# Altium project LOGTURTLE_APR_25_TX.PrjPcb (part 1 of 2)
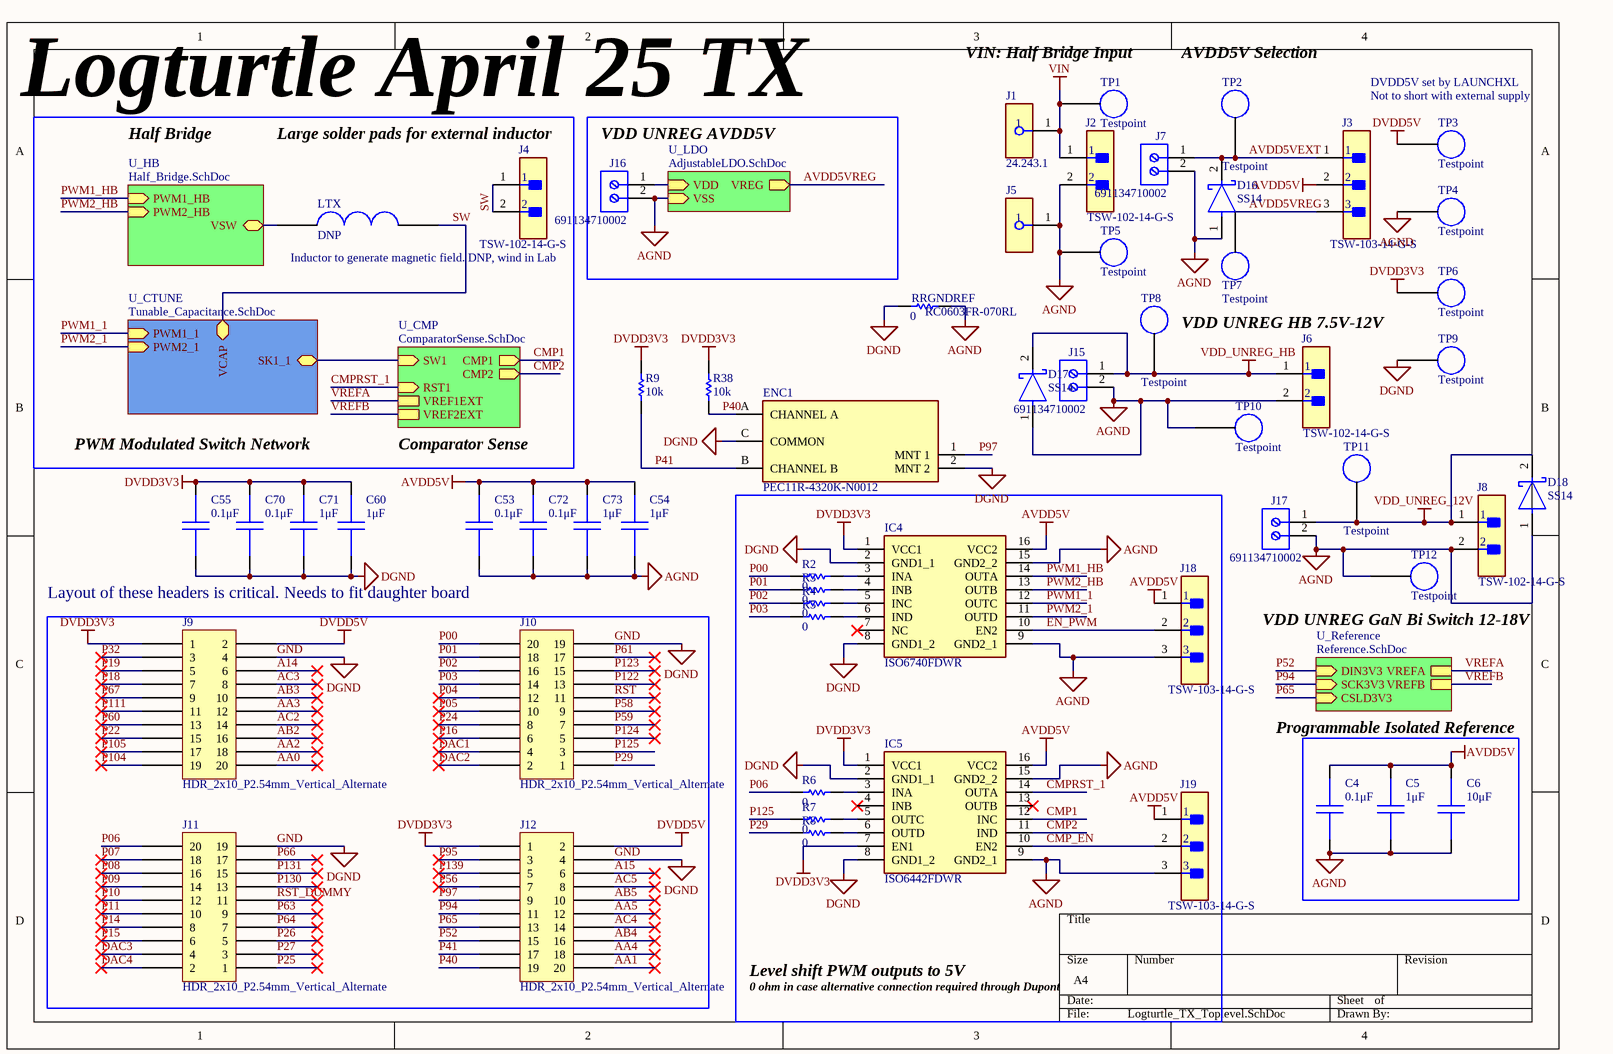
[diagram p0: Logturtle_TX_Toplevel.SchDoc]
7 sheets, 253 parts. Net scope: hierarchical (ports join the sheet entries above them; power ports are global).
Board file: LOGTURTLE_APR_25_TX.PcbDoc
Sheets:
  Logturtle_TX_Toplevel.SchDoc
    U_HB = Half_Bridge.SchDoc
    U_CTUNE = Tunable_Capacitance.SchDoc
      BiG1 = BiGaN.SchDoc
    U_CMP = ComparatorSense.SchDoc
    U_LDO = AdjustableLDO.SchDoc
    U_Reference = Reference.SchDoc

## Sheet Logturtle_TX_Toplevel.SchDoc
size A4; SheetNumber: 1; SheetTotal: 7

### Parts
C4  0.1μF  [CAPC1608X90N]
C5  1μF  [CAPC1608X09N]
C6  10μF  [CAPC2012X14N]
C53  0.1μF  [CAPC1608X90N]
C54  1μF  [CAPC1608X09N]
C55  0.1μF  [CAPC1608X90N]
C60  1μF  [CAPC1608X09N]
C70  0.1μF  [CAPC1608X90N]
C71  1μF  [CAPC1608X09N]
C72  0.1μF  [CAPC1608X90N]
C73  1μF  [CAPC1608X09N]
D16  SS14  [FP-403AE-MFG]
D17  SS14  [FP-403AE-MFG]
D18  SS14  [FP-403AE-MFG]
ENC1  PEC11R-4320K-N0012  [FP-PEC11R-4320K-N0012-MFG]
IC4  ISO6740FDWR  [SOIC127P1030X255-16N]
IC5  ISO6442FDWR  [SOIC127P1030X255-16N]
J1  24.243.1  [FP-24_243_1-MFG]
J2  TSW-102-14-G-S  [FP-TSW-102-14-G-S-MFG]
J3  TSW-103-14-G-S  [FP-TSW-103-14-G-S-MFG]
J4  TSW-102-14-G-S  [FP-TSW-102-14-G-S-MFG]
J5  (no value)  [FP-24_243_2-MFG]
J6  TSW-102-14-G-S  [FP-TSW-102-14-G-S-MFG]
J7  691134710002  [691134710002]
J8  TSW-102-14-G-S  [FP-TSW-102-14-G-S-MFG]
J9  HDR_2x10_P2.54mm_Vertical_Alternate  [HDR_2x10_P2.54mm_Vertical - Alternate]
J10  HDR_2x10_P2.54mm_Vertical_Alternate  [HDR_2x10_P2.54mm_Vertical - Alternate]
J11  HDR_2x10_P2.54mm_Vertical_Alternate  [HDR_2x10_P2.54mm_Vertical - Alternate]
J12  HDR_2x10_P2.54mm_Vertical_Alternate  [HDR_2x10_P2.54mm_Vertical - Alternate]
J15  691134710002  [691134710002]
J16  691134710002  [691134710002]
J17  691134710002  [691134710002]
J18  TSW-103-14-G-S  [FP-TSW-103-14-G-S-MFG]
J19  TSW-103-14-G-S  [FP-TSW-103-14-G-S-MFG]
LTX  DNP  [InductorTerminals]
R2  value 0  [RESC1608X55N]  (hidden comment: RC0603FR-070RL)
R3  value 0  [RESC1608X55N]  (hidden comment: RC0603FR-070RL)
R4  value 0  [RESC1608X55N]  (hidden comment: RC0603FR-070RL)
R5  value 0  [RESC1608X55N]  (hidden comment: RC0603FR-070RL)
R6  value 0  [RESC1608X55N]  (hidden comment: RC0603FR-070RL)
R7  value 0  [RESC1608X55N]  (hidden comment: RC0603FR-070RL)
R8  value 0  [RESC1608X55N]  (hidden comment: RC0603FR-070RL)
R9  value 10k  [RESC1608X55N]  (hidden comment: RC0603FR0710KL)
R38  value 10k  [RESC1608X55N]  (hidden comment: RC0603FR0710KL)
RRGNDREF  RC0603FR-070RL  value 0  [RESC1608X55N]
TP1  Testpoint  [TP_5006]
TP2  Testpoint  [TP_5006]
TP3  Testpoint  [TP_5006]
TP4  Testpoint  [TP_5006]
TP5  Testpoint  [TP_5006]
TP6  Testpoint  [TP_5006]
TP7  Testpoint  [TP_5006]
TP8  Testpoint  [TP_5006]
TP9  Testpoint  [TP_5006]
TP10  Testpoint  [TP_5006]
TP11  Testpoint  [TP_5006]
TP12  Testpoint  [TP_5006]

### Blocks framed on the sheet
VDD UNREG AVDD5V: J16
Level shift PWM outputs to 5V: IC4 IC5 J18 J19 R2-R8

### Sub-sheets
U_CMP = ComparatorSense.SchDoc: SW1 (in), CMP1 (out), CMP2 (out), RST1 (in), VREF1EXT, VREF2EXT
U_CTUNE = Tunable_Capacitance.SchDoc: PWM1_1 (in), PWM2_1 (in), VCAP (bidir), SK1_1 (bidir)
U_HB = Half_Bridge.SchDoc: VSW (bidir), PWM1_HB (in), PWM2_HB (in)
U_LDO = AdjustableLDO.SchDoc: VDD (in), VREG (out), VSS (in)
U_Reference = Reference.SchDoc: VREFA, VREFB, DIN3V3 (in), SCK3V3 (in), CSLD3V3 (in)

### Nets
AGND: C4.1 C5.1 C6.1 C53.1 C54.1 C72.1 C73.1 D16.1(A) D17.1(A) D18.1(A) IC4.9(GND2_1) IC4.15(GND2_2) IC5.9(GND2_1) IC5.15(GND2_2) J2.2 J5.1 J6.2 J7.2 J8.2 J15.2 J16.2 J17.2 J18.3 J19.3 RRGNDREF.1 TP4.1 TP5.1 TP10.1 TP12.1 ; sheet U_LDO/VSS  [project net S2]
AVDD5V: C4.2 C5.2 C6.2 C53.2 C54.2 C72.2 C73.2 IC4.16(VCC2) IC5.16(VCC2) J3.2 J18.1 J19.1
DVDD3V3: C55.2 C60.2 C70.2 C71.2 IC4.1(VCC1) IC5.1(VCC1) IC5.7(EN1) J9.1 J12.1 R9.2 R38.2 TP6.1
DVDD5V: J9.2 J12.2 TP3.1
GND: C55.1 C60.1 C70.1 C71.1 ENC1.2(MNT_2) ENC1.C(COMMON) IC4.2(GND1_1) IC4.8(GND1_2) IC5.2(GND1_1) IC5.8(GND1_2) J9.4 J10.19 J11.19 J12.4 RRGNDREF.2 TP9.1  [also labelled DGND]
VDD_UNREG_12V: D18.2(C) J8.1 J17.1 TP11.1
VDD_UNREG_HB: D17.2(C) J6.1 J15.1 TP8.1
VIN: J1.1 J2.1 TP1.1
A14: J9.6
A15: J12.6
AA0: J9.20
AA1: J12.20
AA2: J9.18
AA3: J9.12
AA4: J12.18
AA5: J12.12
AB2: J9.16
AB3: J9.10
AB4: J12.16
AB5: J12.10
AC2: J9.14
AC3: J9.8
AC4: J12.14
AC5: J12.8
AVDD5VEXT: D16.2(C) J3.1 J7.1 TP2.1
AVDD5VREG: J3.3 TP7.1 ; sheet U_LDO/VREG
CMP1: IC5.12(INC) ; sheet U_CMP/CMP1
CMP2: IC5.11(IND) ; sheet U_CMP/CMP2
CMP_EN: IC5.10(EN2) J19.2
CMPRST_1: IC5.14(OUTA) ; sheet U_CMP/RST1
DAC1: J10.4
DAC2: J10.2
DAC3: J11.4
DAC4: J11.2
EN_PWM: IC4.10(EN2) J18.2
P00: J10.20 R2.1
P01: J10.18 R3.1
P02: J10.16 R4.1
P03: J10.14 R5.1
P04: J10.12
P05: J10.10
P06: J11.20 R6.1
P07: J11.18
P08: J11.16
P09: J11.14
P10: J11.12
P11: J11.10
P14: J11.8
P15: J11.6
P16: J10.6
P18: J9.7
P19: J9.5
P22: J9.15
P24: J10.8
P25: J11.1
P26: J11.5
P27: J11.3
P29: J10.1 R8.1
P32: J9.3
P40: ENC1.A(CHANNEL_A) J12.19 R38.1
P41: ENC1.B(CHANNEL_B) J12.17 R9.1
P52: J12.15 ; sheet U_Reference/DIN3V3  [project net DIN3V3]
P56: J12.7
P58: J10.9
P59: J10.7
P60: J9.13
P61: J10.17
P63: J11.9
P64: J11.7
P65: J12.13 ; sheet U_Reference/CSLD3V3  [project net CSLD3V3]
P66: J11.17
P67: J9.9
P94: J12.11 ; sheet U_Reference/SCK3V3
P95: J12.3
P97: ENC1.1(MNT_1) J12.9
P104: J9.19
P105: J9.17
P111: J9.11
P122: J10.13
P123: J10.15
P124: J10.5
P125: J10.3 R7.1
P130: J11.13
P131: J11.15
P139: J12.5
PWM1_1: IC4.12(OUTC) ; sheet U_CTUNE/PWM1_1
PWM1_HB: IC4.14(OUTA) ; sheet U_HB/PWM1_HB
PWM2_1: IC4.11(OUTD) ; sheet U_CTUNE/PWM2_1
PWM2_HB: IC4.13(OUTB) ; sheet U_HB/PWM2_HB
RST: J10.11
RST_DUMMY: J11.11
S1: sheet U_CTUNE/SK1_1, sheet U_CMP/SW1
SW: J4.1 J4.2 LTX.2 ; sheet U_CTUNE/VCAP
VREFA: sheet U_CMP/VREF1EXT, sheet U_Reference/VREFA  [project net VREF1EXT]
VREFB: sheet U_CMP/VREF2EXT, sheet U_Reference/VREFB  [project net VREF2EXT]
VSW: LTX.1 ; sheet U_HB/VSW
NetC1_2: J16.1 ; sheet U_LDO/VDD
NetIC4_3: IC4.3(INA) R2.2
NetIC4_4: IC4.4(INB) R3.2
NetIC4_5: IC4.5(INC) R4.2
NetIC4_6: IC4.6(IND) R5.2
NetIC5_3: IC5.3(INA) R6.2
NetIC5_5: IC5.5(OUTC) R7.2
NetIC5_6: IC5.6(OUTD) R8.2

Not connected (* = marked no-connect by the designer): IC4 7(NC)*; IC5 4(INB)* 13(OUTB)*

### Notes on the sheet
- (near TP1) VIN: Half Bridge Input
- AVDD5V Selection
- Logturtle April 25 TX
- DVDD5V set by LAUNCHXL
- Not to short with external supply
- Half Bridge
- Large solder pads for external inductor
- Inductor to generate magnetic field. DNP, wind in Lab
- VDD UNREG HB 7.5V-12V
- PWM Modulated Switch Network
- Comparator Sense
- Layout of these headers is critical. Needs to fit daughter board
- (near TP12) VDD UNREG GaN Bi Switch 12-18V
- Programmable Isolated Reference
- 0 ohm in case alternative connection required through Dupont

### Library data of the parts
C4 C53 C55 C70 C72 = CC0603KRX7R7BB104: Ceramic Capacitor, Multilayer, Ceramic, 16V, 10% +Tol, 10% -Tol, X7R, 15% TC, 0.1uF, Surface Mount, 0603 https://www.digikey.ie/en/products/detail/yageo/CC0603KRX7R7BB104/302822; Manufacturer: Yageo; Value: 100nF; Multilayer: Yes; Supplier: Digikey; Supplier Part Number: 311-1088-1-ND; Manufacturer Part Number: CC0603KRX7R7BB104; RoHS: Yes; Category: Ceramic Capacitors; Stock: 8597331; Mounting Technology: Surface Mount; Pins: 2; Dielectric Material: Ceramic; Package Shape: Rectangular; Case/Package: 0603; Terminal Finish: Nickel; Min Operating Temperature: -55°C; Max Operating Temperature: 125°C; JESD-609 Code: e3; Capacitor Type: Ceramic; Tolerance  (fill in as +-): 10%; Package Style: SMTMeter; Packaging: Tape and Reel; Tolerance (fill in as +-): 10%; Rated DC Voltage (URdc): 16V; Temperature Characteristics Code: X7R; Termination: Wraparound; Length: 1.6mm; Width: 0.8mm; Height: 0.8mm; Reach SVHC Compliant: Yes; RoHS Compliant: Yes; ComponentLink1URL: https://datasheet.ciiva.com:443/pdfs/VipMasterIC/IC/YAGO/YAGO-S-A0003557223/YAGO-S-A0003557223-1.pdf?src-supplier=IHS+Markit; ComponentLink1Description: https://datasheet.ciiva.com:443/pdfs/VipMasterIC/IC/YAGO/YAGO-S-A0003557223/YAGO-S-A0003557223-1.pdf?src-supplier=IHS+Markit; ComponentLink2URL: https://datasheet.ciiva.com/11786/0900766b80d84f1d-11786077.pdf?src-supplier=Rs; ComponentLink2Description: https://datasheet.ciiva.com/11786/0900766b80d84f1d-11786077.pdf?src-supplier=Rs; ComponentLink3URL: https://datasheet.ciiva.com/8033/70765-8033799.pdf?src-supplier=Element14; ComponentLink3Description: https://datasheet.ciiva.com/8033/70765-8033799.pdf?src-supplier=Element14; ComponentLink4URL: https://datasheet.ciiva.com/7978/1489800-7978141.pdf?src-supplier=Element14; ComponentLink4Description: https://datasheet.ciiva.com/7978/1489800-7978141.pdf?src-supplier=Element14; ComponentLink5URL: https://datasheet.ciiva.com/28450/1489800-28450552.pdf?src-supplier=Element14; ComponentLink5Description: https://datasheet.ciiva.com/28450/1489800-28450552.pdf?src-supplier=Element14; ComponentLink6URL: https://datasheet.ciiva.com/46430/1734573-46430156.pdf?src-supplier=Element14; ComponentLink6Description: https://datasheet.ciiva.com/46430/1734573-46430156.pdf?src-supplier=Element14; ComponentLink7URL: https://datasheet.ciiva.com/144/mlccorderingcode-144183.pdf?src-supplier=Digikey; ComponentLink7Description: https://datasheet.ciiva.com/144/mlccorderingcode-144183.pdf?src-supplier=Digikey; ComponentLink8URL: https://datasheet.ciiva.com/144/mlccorderingcode-144182.pdf?src-supplier=Digikey; ComponentLink8Description: https://datasheet.ciiva.com/144/mlccorderingcode-144182.pdf?src-supplier=Digikey; ComponentLink9URL: https://datasheet.ciiva.com/144/mlccorderingcode-144184.pdf?src-supplier=Digikey; ComponentLink9Description: https://datasheet.ciiva.com/144/mlccorderingcode-144184.pdf?src-supplier=Digikey; ComponentLink10URL: https://datasheet.ciiva.com/8033/1734573-8033797.pdf?src-supplier=Element14; ComponentLink10Description: https://datasheet.ciiva.com/8033/1734573-8033797.pdf?src-supplier=Element14; ComponentLink11URL: https://datasheet.ciiva.com/13395/upy-gphc-x7r-6-3v-to-50v-8-13395674.pdf?src-supplier=Mouser; ComponentLink11Description: https://datasheet.ciiva.com/13395/upy-gphc-x7r-6-3v-to-50v-8-13395674.pdf?src-supplier=Mouser
C5 C54 C60 C71 C73 = CC0603KRX7R7BB105: Ceramic Capacitor, Multilayer, Ceramic, 16V, 10% +Tol, 10% -Tol, X7R, 15% TC, 1uF, Surface Mount, 0603 https://www.digikey.ie/en/products/detail/yageo/CC0603KRX7R7BB105/2833611; Manufacturer: Yageo; Multilayer: Yes; Supplier: Digikey; Supplier Part Number: 311-1446-6-ND; Manufacturer Part Number: CC0603KRX7R7BB105; RoHS: Yes; Category: Ceramic Capacitors; Stock: 9128438; Mounting Technology: Surface Mount; Pins: 2; Dielectric Material: Ceramic; Package Shape: Rectangular; Case/Package: 0603; Terminal Finish: Nickel; Min Operating Temperature: -55°C; Max Operating Temperature: 125°C; JESD-609 Code: e3; Value: 1uF; Capacitor Type: Ceramic; Tolerance  (fill in as +-): 10%; Package Style: SMTMeter; Packaging: Tape and Reel; Tolerance (fill in as +-): 10%; Rated DC Voltage (URdc): 16V; Temperature Characteristics Code: X7R; Termination: Wraparound; Length: 1.6mm; Width: 0.8mm; Height: 0.8mm; Reach SVHC Compliant: Yes; RoHS Compliant: Yes; ComponentLink1URL: https://datasheet.ciiva.com:443/pdfs/VipMasterIC/IC/YAGO/YAGO-S-A0003557223/YAGO-S-A0003557223-1.pdf?src-supplier=IHS+Markit; ComponentLink1Description: https://datasheet.ciiva.com:443/pdfs/VipMasterIC/IC/YAGO/YAGO-S-A0003557223/YAGO-S-A0003557223-1.pdf?src-supplier=IHS+Markit; ComponentLink2URL: https://datasheet.ciiva.com/8033/1734573-8033801.pdf?src-supplier=Element14; ComponentLink2Description: https://datasheet.ciiva.com/8033/1734573-8033801.pdf?src-supplier=Element14; ComponentLink3URL: https://datasheet.ciiva.com/8033/1734573-8033800.pdf?src-supplier=Element14; ComponentLink3Description: https://datasheet.ciiva.com/8033/1734573-8033800.pdf?src-supplier=Element14; ComponentLink4URL: https://datasheet.ciiva.com/7978/1489800-7978143.pdf?src-supplier=Element14; ComponentLink4Description: https://datasheet.ciiva.com/7978/1489800-7978143.pdf?src-supplier=Element14; ComponentLink5URL: https://datasheet.ciiva.com/28450/1489800-28450557.pdf?src-supplier=Element14; ComponentLink5Description: https://datasheet.ciiva.com/28450/1489800-28450557.pdf?src-supplier=Element14; ComponentLink6URL: https://datasheet.ciiva.com/176/mlccorderingcode-176789.pdf?src-supplier=Digikey; ComponentLink6Description: https://datasheet.ciiva.com/176/mlccorderingcode-176789.pdf?src-supplier=Digikey; ComponentLink7URL: https://datasheet.ciiva.com/176/mlccorderingcode-176788.pdf?src-supplier=Digikey; ComponentLink7Description: https://datasheet.ciiva.com/176/mlccorderingcode-176788.pdf?src-supplier=Digikey; ComponentLink8URL: https://datasheet.ciiva.com/176/mlccorderingcode-176790.pdf?src-supplier=Digikey; ComponentLink8Description: https://datasheet.ciiva.com/176/mlccorderingcode-176790.pdf?src-supplier=Digikey; ComponentLink9URL: https://datasheet.ciiva.com/5425/upy-gphc-x7r-6-3v-to-50v-8-12304-5425495.pdf?src-supplier=Mouser; ComponentLink9Description: https://datasheet.ciiva.com/5425/upy-gphc-x7r-6-3v-to-50v-8-12304-5425495.pdf?src-supplier=Mouser
C6 = GRM21BZ71E106KE15L: Multilayer Ceramic Capacitor, 10 uF, 25 V, ï¿½ 10%, X7R, 0805 [2012 Metric] https://www.digikey.ie/en/products/detail/murata-electronics/GRM21BZ71E106KE15L/13904911; Manufacturer: Murata; Material: 4241ConductorMaterial; Value: 10uF; Voltage Rating: 25V; Supplier: Future Electronics; Supplier Part Number: 6134628; Manufacturer Part Number: GRM21BZ71E106KE15L; Category: Ceramic Capacitors; Stock: 81000; Case/Package: 339Case; Min Operating Temperature: -55°C; Max Operating Temperature: 125°C; Tolerance: 10%; Length: 2mm; Width: 1.25mm; Height: 1.45mm; Thickness: 1.25mm; RoHS Compliant: Yes; ComponentLink1URL: https://datasheet.octopart.com/GRM21BZ71E106KE15L-Murata-datasheet-141278873.pdf?src-supplier=Geoflip; ComponentLink1Description: https://datasheet.octopart.com/GRM21BZ71E106KE15L-Murata-datasheet-141278873.pdf?src-supplier=Geoflip; ComponentLink2URL: https://datasheet.octopart.com/GRM21BZ71E106KE15L-Murata-datasheet-165579666.pdf?src-supplier=TME; ComponentLink2Description: https://datasheet.octopart.com/GRM21BZ71E106KE15L-Murata-datasheet-165579666.pdf?src-supplier=TME; ComponentLink3URL: https://datasheet.octopart.com/GRM21BZ71E106KE15L-Murata-datasheet-140707837.pdf?src-supplier=Ciiva+Crawler; ComponentLink3Description: https://datasheet.octopart.com/GRM21BZ71E106KE15L-Murata-datasheet-140707837.pdf?src-supplier=Ciiva+Crawler; ComponentLink4URL: https://datasheet.octopart.com/GRM21BZ71E106KE15L-Murata-datasheet-138745134.pdf?src-supplier=Ciiva+Crawler; ComponentLink4Description: https://datasheet.octopart.com/GRM21BZ71E106KE15L-Murata-datasheet-138745134.pdf?src-supplier=Ciiva+Crawler
D16-D18 = CMP-2000-04943-2: DIODE SCHOTTKY 40V 1A SMA; Manufacturer: ON Semiconductor; Peak Reverse Current: 0.2mA; Max Junction Temp: +125°C; Standoff Height: 0.05mm; Max Surge Forward Current: 40A; Mouser Description: Schottky Diodes & Rectifiers SMA 40V 1.0A; RoHS: TRUE; Lead Free: Yes; Manufacturer Part Number: SS14; Device Class L3: Schottky Diodes; Category: Diode; Automotive: No; Digikey Description: DIODE SCHOTTKY 40V 1A SMA; ComponentLink2Description: Datasheet; Device Class L2: Diodes; Height: 2.5mm; Temperature Range High: +125°C; ComponentLink2URL: https://www.onsemi.com/pub/Collateral/SS19-D.PDF; Device Class L1: Discrete Semiconductors; Package: 403AE; Octopart: https://octopart.com/ss14-on+semiconductor-29205033; Max Repetitive Reverse Voltage: 40V; Temperature Range Low: -65°C; Forward Current: 1A; Temperature: -65°C to +125°C
ENC1 = CMP-07421-000024-1: ROTARY ENCODER MECHANICAL 12PPR; Detent: Yes; Built in Switch: No; Number of Channels: 2; Pulses per Revolution: 12; Output Type: Quadrature; Width: 12.5mm; Packaging: Bulk; Mount: Through Hole; Min Operating Temperature: -30°C; Termination: PC Pin; Package Quantity: 75; Orientation: Vertical; Encoder Type: Mechanical; RoHS Compliant: Yes; Height: 13.4mm; Length: 26.5mm; Max Operating Temperature: 70°C
IC4 = ISO6440FDWR: Texas Instruments ISO6740FDWR; Manufacturer_Part_Number: ISO6441FDWR; Datasheet Link: https://www.ti.com/lit/ds/symlink/iso6441.pdf?ts=1759392249492&ref_url=https%253A%252F%252Fwww.ti.com%252Fproduct%252FISO6441; Height: 2.55mm; Manufacturer_Name: Texas Instruments
IC5 = ISO6442FDWR: Texas Instruments ISO6742FDWR; Manufacturer_Part_Number: ISO6441FDWR; Datasheet Link: https://www.ti.com/lit/ds/symlink/iso6441.pdf?ts=1759392249492&ref_url=https%253A%252F%252Fwww.ti.com%252Fproduct%252FISO6441; Height: 2.55mm; Manufacturer_Name: Texas Instruments
J1 = CMP-12400-000001-2: Banana Test Connector, 4mm, Socket, PCB Mount, 24 A, 60 VDC, Silver Plated Contacts, Green; Gender: Male; Voltage Rating: 30V; Current Rating: 20A; REACH SVHC: No SVHC; Contact Material: Brass; RoHS Compliant: Yes; Contact Plating: Silver; Voltage Rating (DC): 30V; Length: 24mm; Termination: Solder
J2 J4 J6 J8 = CMP-02766-001740-1: CONN HEADER VERT 2POS 2.54MM; Number of Positions: 2; Max Current Rating: 7.6A; Gender: Male; Max Voltage Rating (AC): 550V; Contact Mating Length: 0.32inch; REACH SVHC: No SVHC; Width: 2.54mm; Insulation Material: PBT; Contact Shape: Square; Contact Plating: Gold; Min Operating Temperature: -55°C; Contact Material: Bronze; Color: Black; Number of Contacts: 2; Housing Material: Polyester; Orientation: Straight; Flammability Rating: UL94 V-0; Max Operating Temperature: 125°C; Contact Type: Male Pin; Radiation Hardening: No; Termination: Solder; RoHS Compliant: Yes; Lead Free: Lead Free; Fastening Type: Pull; Pitch: 2.54mm; Number of Rows: 1; Series: TSW; Insulation Color: Black; Package Quantity: 1; Connector Type: Header; Length: 5.08mm; Contact Finish - Mating: GOLD; Mount: Through Hole; Housing Color: Black; Depth: 2.54mm; Packaging: Bulk
J3 J18 J19 = CMP-02766-001743-1: CONN HEADER VERT 3POS 2.54MM; Max Voltage Rating (AC): 550V; Number of Positions: 3; Max Current Rating: 7.6A; Gender: Male; Termination: Solder; RoHS Compliant: Yes; Mount: Through Hole; Lead Free: Lead Free; Connector Type: Header; REACH SVHC: No SVHC; Insulation Color: Black; Width: 2.54mm; Length: 7.62mm; Flammability Rating: UL94 V-0; Housing Material: Polyester; Contact Material: Bronze; Max Operating Temperature: 125°C; Fastening Type: Pull; Series: TSW; Number of Contacts: 3; Packaging: Bulk; Min Operating Temperature: -55°C; Package Quantity: 1; Height: 10.67mm; Pitch: 2.54mm; Contact Finish - Mating: GOLD; Contact Type: Male Pin; Radiation Hardening: No; Color: Black; Housing Color: Black; Contact Plating: Gold; Orientation: Straight; Number of Rows: 1; Depth: 2.54mm; Insulation Material: PBT; Contact Mating Length: 0.32inch; Contact Shape: Square
J5 = CMP-12400-000002-2: RECEPTACLE, 20A, 4MM, PCB, SOLDER, BLACK; Gender: Male; Current Rating: 20A; Contact Plating: Silver; Termination: Solder; Length: 24mm; REACH SVHC: No SVHC; Contact Material: Brass
J7 J15-J17 = CMP-1502-03295-3: Wire-To-Board Terminal Block, 5mm Pitch, Horizontal, Screw, 2 Poles
LTX = InductorTX
R2-R8 RRGNDREF = RC0603FR-070RL: Resistor, 0 Ohms Jumper 0.1W, 1/10W Chip Resistor 0603 (1608 Metric) Moisture Resistant Thick Film; Manufacturer_Name: YAGEO; Datasheet Link: http://www.yageo.com/documents/recent/PYu-RC0603_51_RoHS_L_v5.pdf; Height: 0.55mm; Manufacturer_Part_Number: RC0603FR-070RL; Mouser Part Number: 603-RC0603FR-070RL; Mouser Price/Stock: https://www.mouser.co.uk/ProductDetail/YAGEO/RC0603FR-070RL?qs=0yPvnVz5%2FmpDQv43TwvCfw%3D%3D; Arrow Part Number: RC0603FR-070RL; Arrow Price/Stock: https://www.arrow.com/en/products/rc0603fr-070rl/yageo?region=nac
R9 R38 = RC0603FR0710KL: Resistor, 10 kOhms ±1% 0.1W, 1/10W Chip Resistor 0603 (1608 Metric) Moisture Resistant Thick Film; Manufacturer_Name: YAGEO; Datasheet Link: http://www.yageo.com/documents/recent/PYu-RC0603_51_RoHS_L_v5.pdf; Height: 0.55mm; Manufacturer_Part_Number: RC0603FR0710KL; Arrow Part Number: RC0603FR0710KL; Arrow Price/Stock: https://www.arrow.com/en/products/rc0603fr-0710kl/yageo

## Sheet Half_Bridge.SchDoc
size A2; SheetNumber: 5; SheetTotal: 8
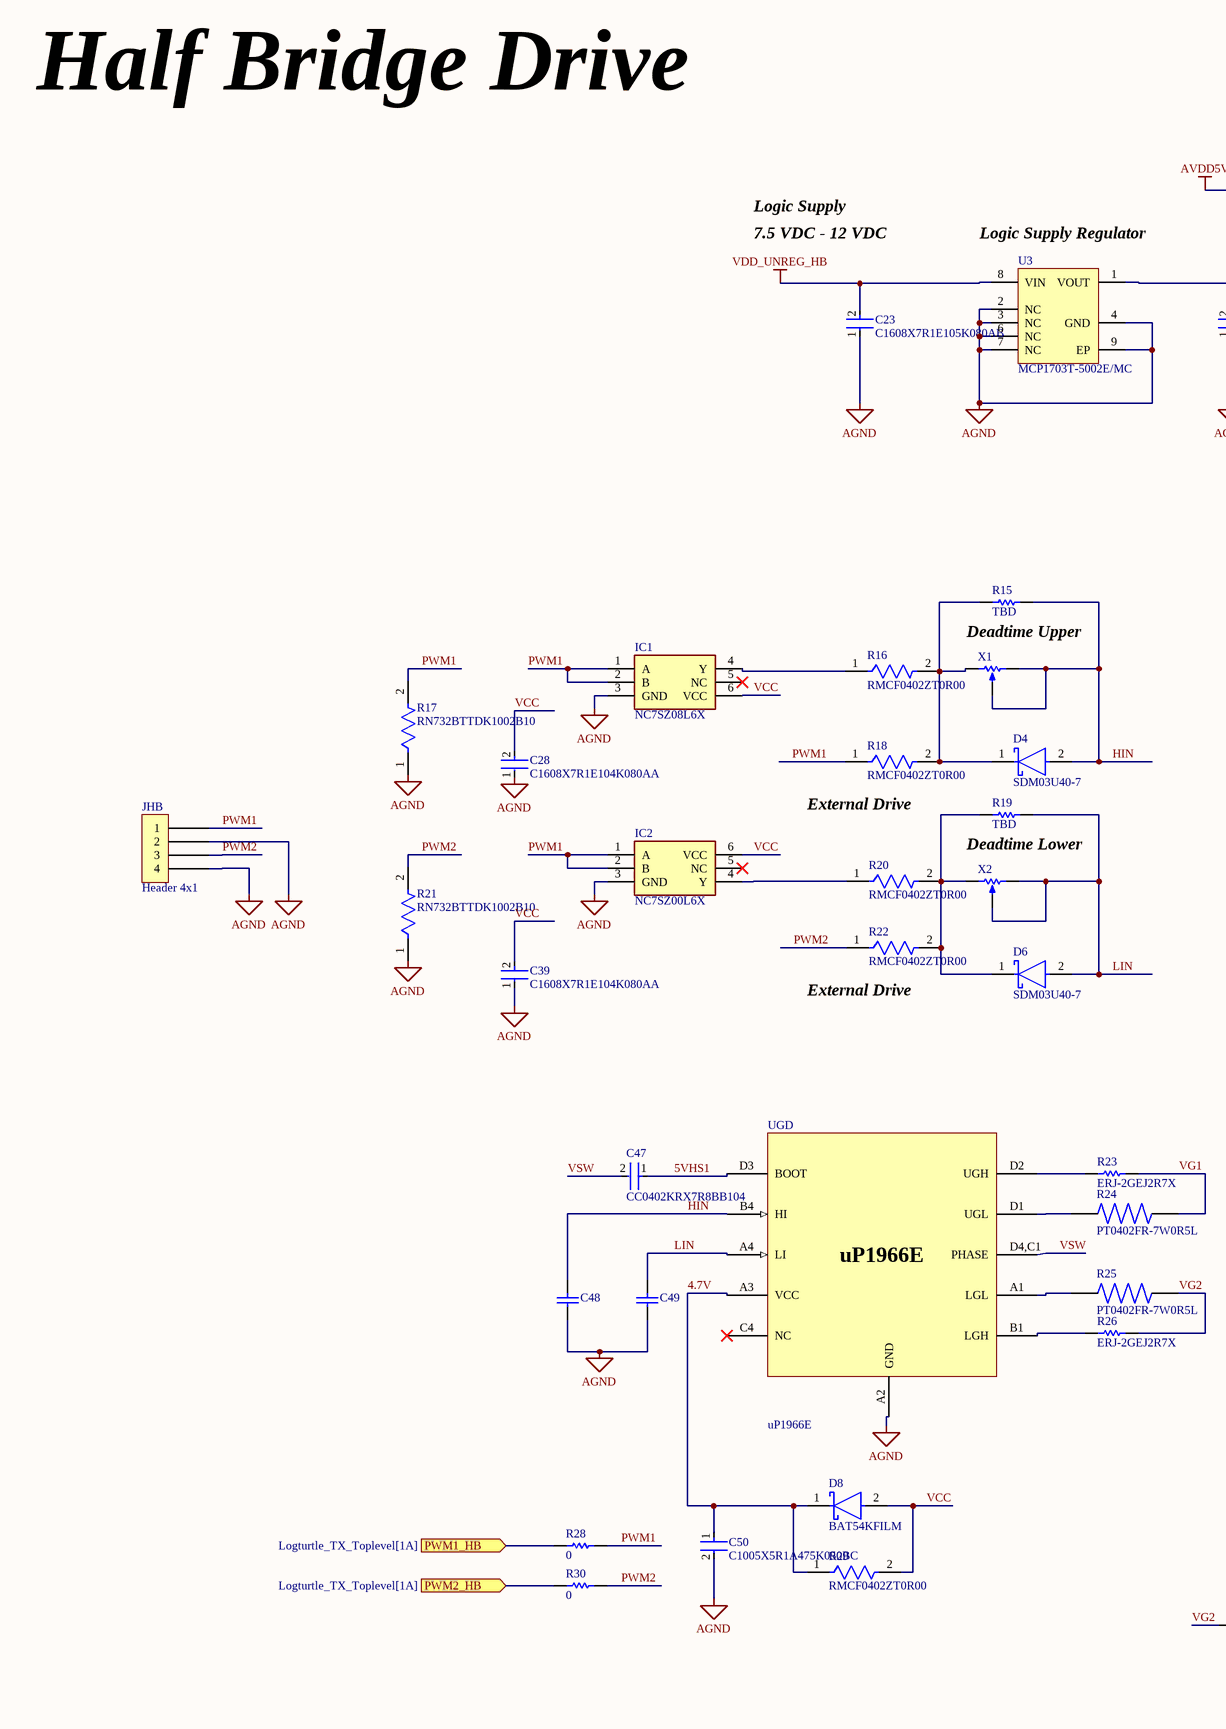
[diagram p1: Half_Bridge.SchDoc, left]
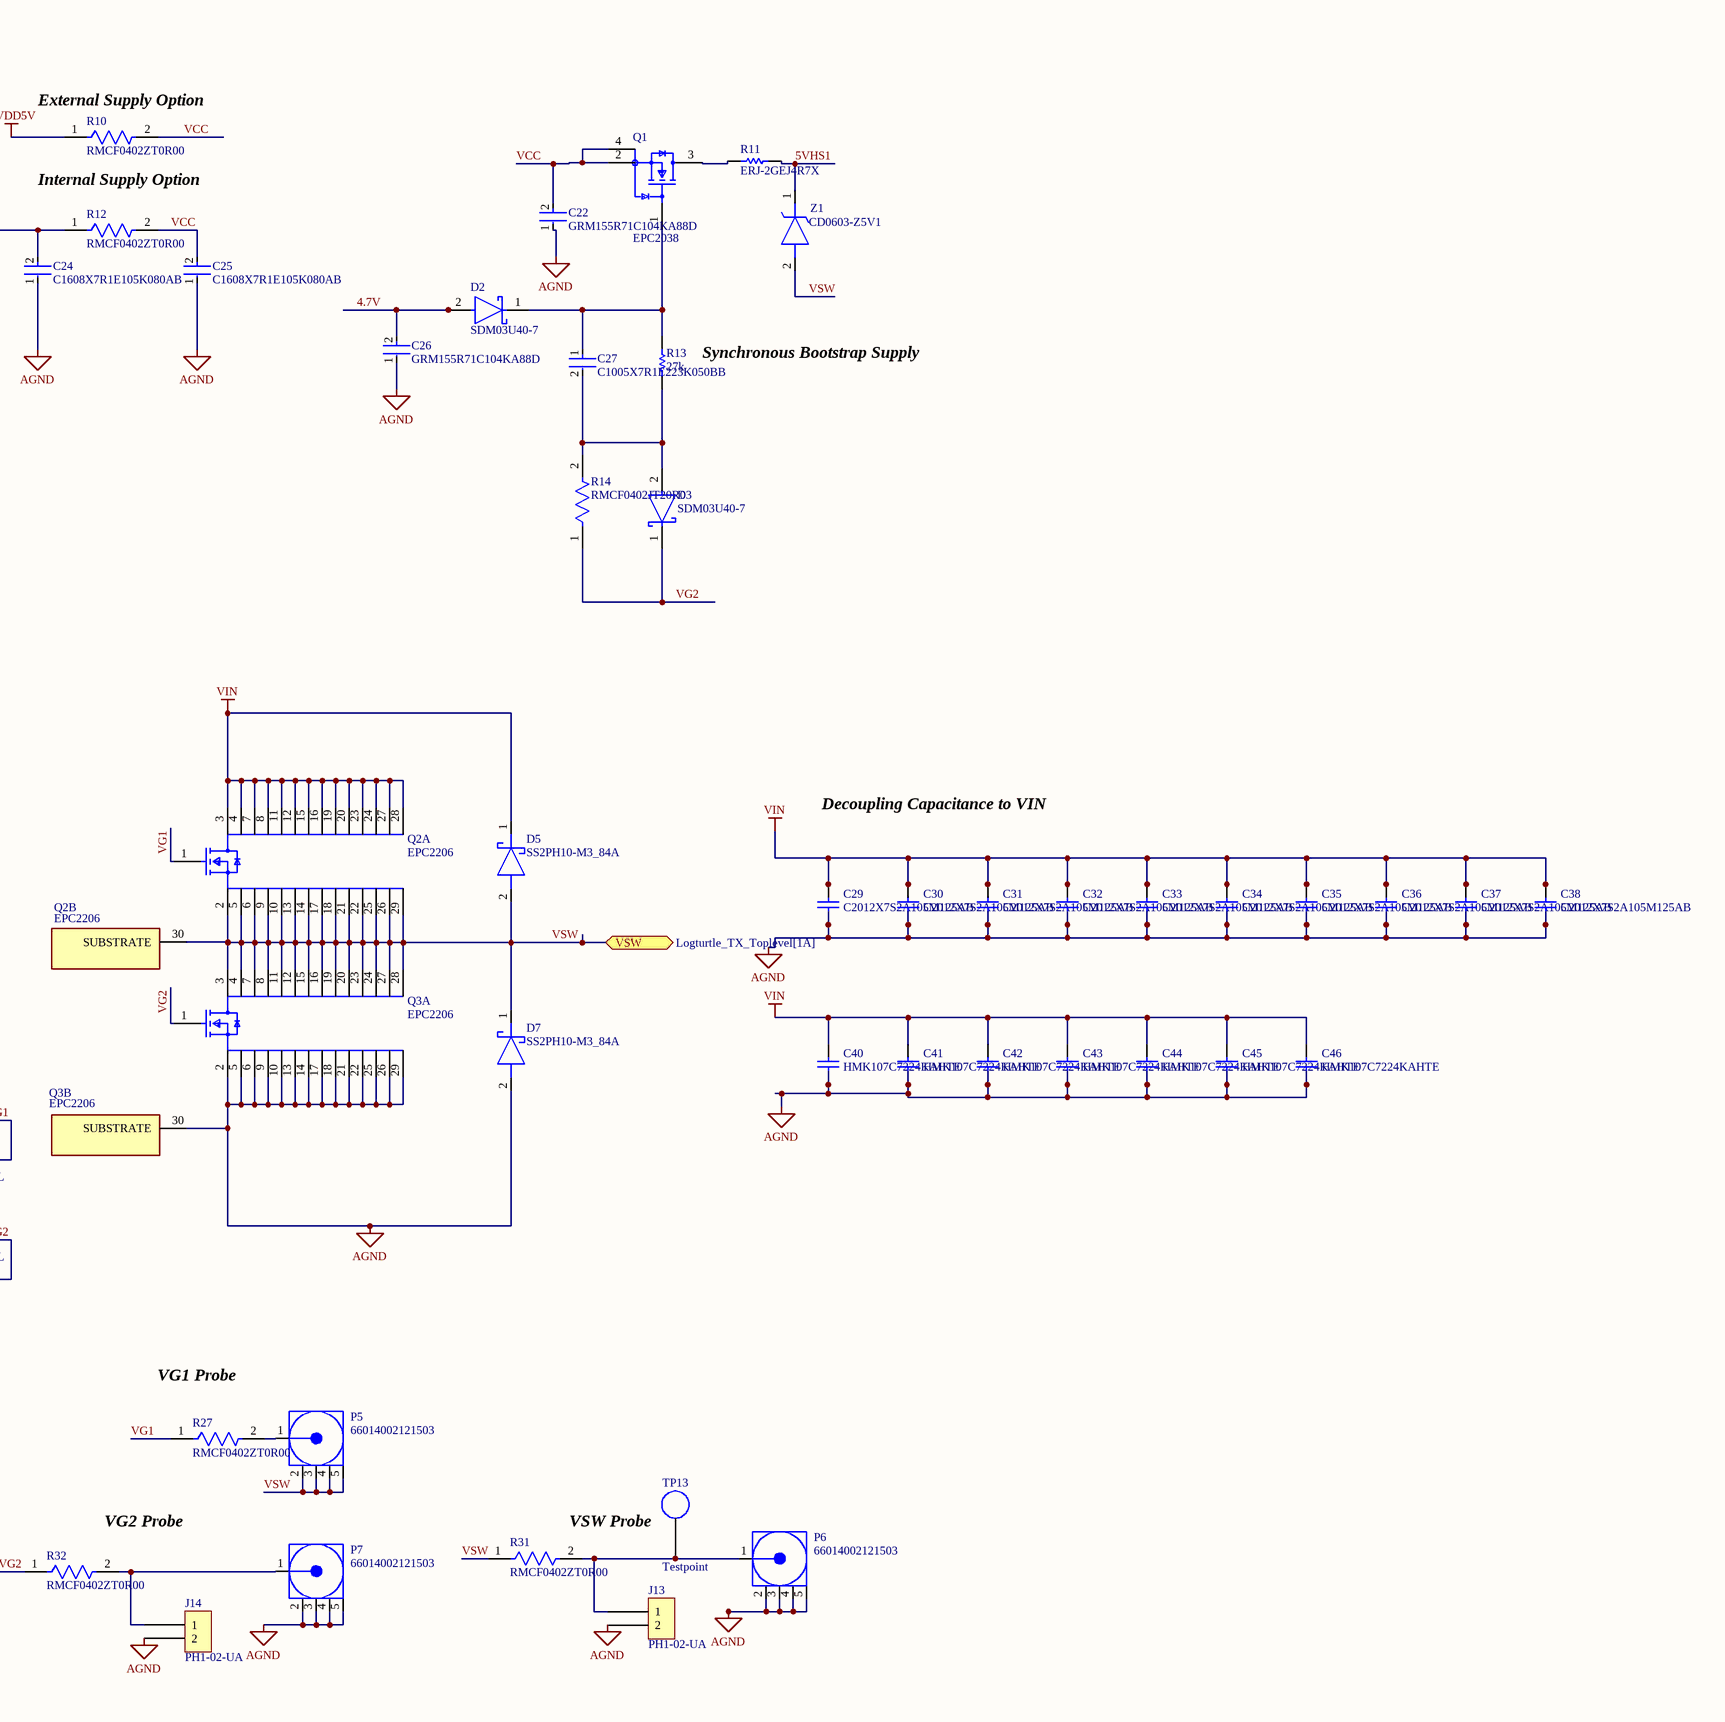
[diagram p2: Half_Bridge.SchDoc, right]

### Parts
C22  GRM155R71C104KA88D  [FP-GRM15-MFG]
C23  C1608X7R1E105K080AB  [FP-C1608-080-0_1-IPC_C]
C24  C1608X7R1E105K080AB  [FP-C1608-080-0_1-IPC_C]
C25  C1608X7R1E105K080AB  [FP-C1608-080-0_1-IPC_C]
C26  GRM155R71C104KA88D  [FP-GRM15-MFG]
C27  C1005X7R1E223K050BB  [FP-C1005-050-0_05-IPC_C]
C28  C1608X7R1E104K080AA  [FP-C1608-080-0_1-IPC_B]
C29  C2012X7S2A105M125AB  [CAPC2012X145N]
C30  C2012X7S2A105M125AB  [CAPC2012X145N]
C31  C2012X7S2A105M125AB  [CAPC2012X145N]
C32  C2012X7S2A105M125AB  [CAPC2012X145N]
C33  C2012X7S2A105M125AB  [CAPC2012X145N]
C34  C2012X7S2A105M125AB  [CAPC2012X145N]
C35  C2012X7S2A105M125AB  [CAPC2012X145N]
C36  C2012X7S2A105M125AB  [CAPC2012X145N]
C37  C2012X7S2A105M125AB  [CAPC2012X145N]
C38  C2012X7S2A105M125AB  [CAPC2012X145N]
C39  C1608X7R1E104K080AA  [FP-C1608-080-0_1-IPC_B]
C40  HMK107C7224KAHTE  [CAPC1608X90N]
C41  HMK107C7224KAHTE  [CAPC1608X90N]
C42  HMK107C7224KAHTE  [CAPC1608X90N]
C43  HMK107C7224KAHTE  [CAPC1608X90N]
C44  HMK107C7224KAHTE  [CAPC1608X90N]
C45  HMK107C7224KAHTE  [CAPC1608X90N]
C46  HMK107C7224KAHTE  [CAPC1608X90N]
C47  CC0402KRX7R8BB104  [FP-CC0402-MFG]
C48  VJ0402A101KXAMC  [CAPC1005X60X26NL10T16]  (value not drawn)
C49  VJ0402A101KXAMC  [CAPC1005X60X26NL10T16]  (value not drawn)
C50  C1005X5R1A475K050BC  [FP-C1005-050-0_15-MFG]
D2  SDM03U40-7  [FP-SOD523-MFG]
D3  SDM03U40-7  [FP-SOD523-MFG]
D4  SDM03U40-7  [FP-SOD523-MFG]
D5  SS2PH10-M3_84A  [DO-220AA]
D6  SDM03U40-7  [FP-SOD523-MFG]
D7  SS2PH10-M3_84A  [DO-220AA]
D8  BAT54KFILM  [FP-SOD-523-MFG]
IC1  NC7SZ08L6X  [NC7SZ08L6X]
IC2  NC7SZ00L6X  [NC7SZ00L6X]
J13  PH1-02-UA  [HDRV2W64P0X254_1X2_508X250X850P]
J14  PH1-02-UA  [HDRV2W64P0X254_1X2_508X250X850P]
JHB  Header 4x1  [HDRV4W64P0X254_1X4_1016X250X901P]
P5  66014002121503  [66014002121503]
P6  66014002121503  [66014002121503]
P7  66014002121503  [66014002121503]
Q1  EPC2038  [FP-EPC2038-MFG]
Q2  EPC2206  [FP-EPC2206-MFG]  (parts A,B of 2)
Q3  EPC2206  [FP-EPC2206-MFG]  (parts A,B of 2)
R10  RMCF0402ZT0R00  [FP-RMCF0402-MFG]
R11  ERJ-2GEJ4R7X  [RESC1005X40X25LL05T05]
R12  RMCF0402ZT0R00  [FP-RMCF0402-MFG]
R13  value 27k  [RESC1608X55N]  (hidden comment: RC0603FR-0727KL)
R14  RMCF0402JT20R0  [FP-RMCF0402-IPC_C]
R15  value TBD  [RESC1608X55N]  (hidden comment: RC0603FR-070RL)
R16  RMCF0402ZT0R00  [FP-RMCF0402-MFG]
R17  RN732BTTDK1002B10  [FP-RN732B-MFG]
R18  RMCF0402ZT0R00  [FP-RMCF0402-MFG]
R19  value TBD  [RESC1608X55N]  (hidden comment: RC0603FR-070RL)
R20  RMCF0402ZT0R00  [FP-RMCF0402-MFG]
R21  RN732BTTDK1002B10  [FP-RN732B-MFG]
R22  RMCF0402ZT0R00  [FP-RMCF0402-MFG]
R23  ERJ-2GEJ2R7X  [RESC1005X40X25ML05T05]
R24  PT0402FR-7W0R5L  [RESC1005X40N]
R25  PT0402FR-7W0R5L  [RESC1005X40N]
R26  ERJ-2GEJ2R7X  [RESC1005X40X25ML05T05]
R27  RMCF0402ZT0R00  [FP-RMCF0402-MFG]
R28  value 0  [RESC1608X55N]  (hidden comment: RC0603FR-070RL)
R29  RMCF0402ZT0R00  [FP-RMCF0402-MFG]
R30  value 0  [RESC1608X55N]  (hidden comment: RC0603FR-070RL)
R31  RMCF0402ZT0R00  [FP-RMCF0402-MFG]
R32  RMCF0402ZT0R00  [FP-RMCF0402-MFG]
TP13  Testpoint  [TP_5006]
U3  MCP1703T-5002E/MC  [DFN-MC8]
UGD  uP1966E  [uP1966E]
X1  3296W-1-101LF  [3296W1200LF]  (value not drawn)
X2  3296W-1-101LF  [3296W1200LF]  (value not drawn)
Z1  CD0603-Z5V1  [DIOC1709X85N]

### Ports
PWM1_HB (in, see Logturtle_TX_Toplevel[1A]), PWM2_HB (in, see Logturtle_TX_Toplevel[1A]), VSW (bidir, see Logturtle_TX_Toplevel[1A])

### Nets
AGND: C22.1 C23.1 C24.1 C25.1 C26.1 C28.1 C29.2 C30.2 C31.2 C32.2 C33.2 C34.2 C35.2 C36.2 C37.2 C38.2 C39.1 C40.2 C41.2 C42.2 C43.2 C44.2 C45.2 C46.2 C48.1 C49.1 C50.2 D7.2(A) IC1.3(GND) IC2.3(GND) J13.2 J14.2 JHB.2 JHB.4 P6.2(GND) P6.3(GND) P6.4(GND) P6.5(GND) P7.2(GND) P7.3(GND) P7.4(GND) P7.5(GND) Q3.2(SOURCE) Q3.5(SOURCE) Q3.6(SOURCE) Q3.9(SOURCE) Q3.10(SOURCE) Q3.13(SOURCE) Q3.14(SOURCE) Q3.17(SOURCE) Q3.18(SOURCE) Q3.21(SOURCE) Q3.22(SOURCE) Q3.25(SOURCE) Q3.26(SOURCE) Q3.29(SOURCE) Q3.30(SUBSTRATE) R17.1 R21.1 U3.2(NC) U3.3(NC) U3.4(GND) U3.6(NC) U3.7(NC) U3.9(EP) UGD.A2(GND)  [project net S2]
AVDD5V: R10.1
VDD_UNREG_HB: C23.2 U3.8(VIN)
VIN: C29.1 C30.1 C31.1 C32.1 C33.1 C34.1 C35.1 C36.1 C37.1 C38.1 C40.1 C41.1 C42.1 C43.1 C44.1 C45.1 C46.1 D5.1(K) Q2.3(DRAIN) Q2.4(DRAIN) Q2.7(DRAIN) Q2.8(DRAIN) Q2.11(DRAIN) Q2.12(DRAIN) Q2.15(DRAIN) Q2.16(DRAIN) Q2.19(DRAIN) Q2.20(DRAIN) Q2.23(DRAIN) Q2.24(DRAIN) Q2.27(DRAIN) Q2.28(DRAIN)
4.7V: C26.2 C50.1 D2.2(A) D8.1(C) R29.1 UGD.A3(VCC)
5VHS1: C47.1 R11.2 UGD.D3(BOOT) Z1.1(K)
HIN: C48.2 D4.2(A) R15.2 UGD.B4(HI) X1.2(BOT) X1.3(TAP)
LIN: C49.2 D6.2(A) R19.2 UGD.A4(LI) X2.2(BOT) X2.3(TAP)
PWM1: IC1.1(A) IC1.2(B) IC2.1(A) IC2.2(B) JHB.1 R17.2 R18.1 R28.2
PWM1_HB: R28.1 ; port PWM1_HB
PWM2: JHB.3 R21.2 R22.1 R30.2
PWM2_HB: R30.1 ; port PWM2_HB
VCC: C22.2 C25.2 C28.2 C39.2 D8.2(A) IC1.6(VCC) IC2.6(VCC) Q1.2(S) Q1.4(S) R10.2 R12.2 R29.2
VG1: Q2.1(GATE) R23.2 R24.2 R27.1
VG2: D3.1(C) Q3.1(GATE) R14.1 R25.2 R26.2 R32.1
VSW: C47.2 D5.2(A) D7.1(K) P5.2(GND) P5.3(GND) P5.4(GND) P5.5(GND) Q2.2(SOURCE) Q2.5(SOURCE) Q2.6(SOURCE) Q2.9(SOURCE) Q2.10(SOURCE) Q2.13(SOURCE) Q2.14(SOURCE) Q2.17(SOURCE) Q2.18(SOURCE) Q2.21(SOURCE) Q2.22(SOURCE) Q2.25(SOURCE) Q2.26(SOURCE) Q2.29(SOURCE) Q2.30(SUBSTRATE) Q3.3(DRAIN) Q3.4(DRAIN) Q3.7(DRAIN) Q3.8(DRAIN) Q3.11(DRAIN) Q3.12(DRAIN) Q3.15(DRAIN) Q3.16(DRAIN) Q3.19(DRAIN) Q3.20(DRAIN) Q3.23(DRAIN) Q3.24(DRAIN) Q3.27(DRAIN) Q3.28(DRAIN) R31.1 UGD.D4,C1(PHASE) Z1.2(A) ; port VSW
NetC24_2: C24.2 R12.1 U3.1(VOUT)
NetC27_1: C27.1 D2.1(C) Q1.1(G) R13.2
NetC27_2: C27.2 D3.2(A) R13.1 R14.2
NetD4_1: D4.1(C) R15.1 R16.2 R18.2 X1.1(TOP)
NetD6_1: D6.1(C) R19.1 R20.2 R22.2 X2.1(TOP)
NetIC1_4: IC1.4(Y) R16.1
NetIC2_4: IC2.4(Y) R20.1
NetJ13_1: J13.1 P6.1(Signal) R31.2 TP13.1
NetJ14_1: J14.1 P7.1(Signal) R32.2
NetP5_1: P5.1(Signal) R27.2
NetQ1_3: Q1.3(D) R11.1
NetR23_1: R23.1 UGD.D2(UGH)
NetR24_1: R24.1 UGD.D1(UGL)
NetR25_1: R25.1 UGD.A1(LGL)
NetR26_1: R26.1 UGD.B1(LGH)

Not connected (* = marked no-connect by the designer): IC1 5(NC)*; IC2 5(NC)*; UGD C4(NC)*

### Notes on the sheet
- Half Bridge Drive
- (near R10) External Supply Option
- Logic Supply
- 7.5 VDC - 12 VDC
- (near U3) Logic Supply Regulator
- Internal Supply Option
- (near R13) Synchronous Bootstrap Supply
- Deadtime Upper
- (near R18) External Drive
- Deadtime Lower
- Decoupling Capacitance to VIN
- (near R22) External Drive
- VG1 Probe
- (near R32) VG2 Probe
- VSW Probe

### Library data of the parts
C22 C26 = CMP-2100-03641-2: CAP CER 0.1UF 16V X7R 0402; Manufacturer: Murata; Standoff Height: 0mm; Tolerance: 10%; Voltage Rating: 16Vdc; Material: Ceramic; Capacitance: 0.10μF; Value: 0.10μF; RoHS: TRUE; Manufacturer Part Number: GRM155R71C104KA88D; Temperature Characteristic: X7R; Octopart: https://octopart.com/grm155r71c104ka88d-murata-196880; Digikey Description: CAP CER 0.1UF 16V X7R 0402; Device Class L3: Ceramic Capacitors; Height: 0.55mm; ComponentLink2Description: Datasheet; Temperature Range Low: -55°C; Ipc Land Pattern Name: CAPC10050X219; ComponentLink2URL: https://search.murata.co.jp/Ceramy/image/img/A01X/G101/ENG/GRM155R71H471KA01-01A.pdf; Device Class L1: Passive Components; Lead Free: yes; Category: Cap; Package: GRM15; Temperature: -55°C to +125°C; Device Class L2: Capacitors; Temperature Range High: +125°C; Mouser Description: 0402 0.1 uF 16V ±10 % Tolerance X7R SMT Multilayer Ceramic Capacitor
C23-C25 = CMP-08246-005723-1: Multilayer Ceramic Capacitors 1μF ±10% 25V X7R SMD 0603; Capacitance: 1uF; Mount: Surface Mount; Series: C; Tolerance: 10%; RoHS Compliant: Yes; Packaging: Tape and Reel; Case Code (Imperial): 0603; Height: 0.8mm; Case/Package: 0603; REACH SVHC: No SVHC; Thickness: 0.037inch; Voltage: 25V; Voltage Rating (DC): 25V; Construction: Flat; Case Code (Metric): 1608; Radiation Hardening: No; Package Quantity: 4000; Weight: 7.1E-05oz; Width: 0.031inch; Resistor Type: Ceramic; Termination: SMD/SMT; Depth: 0.8mm; Lead Free: Lead Free; Min Operating Temperature: -55°C; Length: 1.6mm; Dielectric: X7R; Max Operating Temperature: 125°C; Voltage Rating: 25V; Dielectric Material: Ceramic
C27 = CMP-08246-005626-1: Multilayer Ceramic Capacitors 22nF ±10% 25V X7R SMD 0402; Tolerance: 10%; Series: C; Depth: 0.5mm; Package Quantity: 1; Construction: Flat; Capacitance: 22nF; Lead Free: Lead Free; Case Code (Imperial): 0402; Weight: 2.3E-05oz; RoHS Compliant: Yes; Resistor Type: Ceramic; Max Operating Temperature: 125°C; Termination: SMD/SMT; Dielectric: X7R; Thickness: 0.022inch; Voltage Rating: 25V; Width: 0.02inch; REACH SVHC: No SVHC; Voltage Rating (DC): 25V; Case Code (Metric): 1005; Mount: Surface Mount; Height: 0.5mm; Packaging: Tape and Reel; Radiation Hardening: No; Number of Pins: 2; Case/Package: 0402; Min Operating Temperature: -55°C; Length: 1mm; Dielectric Material: Ceramic
C28 C39 = CMP-2000-05395-2: Multilayer Ceramic Capacitors 100nF ±10% 25V X7R SMD 0603; Lead Free: Lead Free; REACH SVHC: No SVHC; Tolerance: 10%; Case Code (Metric): 1608; Packaging: Tape and Reel; Radiation Hardening: No; Dielectric: X7R; Height: 0.8mm; Width: 0.031inch; Voltage Rating (DC): 25V; Case Code (Imperial): 0603; Mount: Surface Mount; RoHS Compliant: Yes; Depth: 0.8mm; Min Operating Temperature: -55°C; Capacitance: 100nF; Number of Pins: 2; Weight: 7.1E-05oz; Max Operating Temperature: 125°C; Dielectric Material: Ceramic; Resistor Type: Ceramic; Construction: Flat; Thickness: 0.037inch; Package Quantity: 1; Voltage Rating: 25V; Series: C; Voltage: 25V; Case/Package: 0603; Termination: SMD/SMT; Length: 1.6mm
C29-C38 = C2012X7S2A105M125AB: Multilayer Ceramic Capacitors 1μF ±20% 100V X7S SMD 0805; Manufacturer_Name: TDK; Capacitance: 1uF; Datasheet Link: https://product.tdk.com/info/en/catalog/datasheets/mlcc_commercial_midvoltage_en.pdf; Height: 1.45mm; Manufacturer_Part_Number: C2012X7S2A105M125AB; Mouser Part Number: 810-C2012X7S2A105M; Mouser Price/Stock: https://www.mouser.co.uk/ProductDetail/TDK/C2012X7S2A105M125AB/?qs=NRhsANhppD%252BVdUt3hZqBMQ%3D%3D
C40-C46 = HMK107C7224KAHTE: Capacitor; Manufacturer_Name: TAIYO YUDEN; Capacitance: 100nF; Datasheet Link: https://componentsearchengine.com/Datasheets/1/HMK107C7224KAHTE.pdf; Height: 0.9mm; Manufacturer_Part_Number: HMK107C7224KAHTE; Mouser Part Number: 963-HMK107C7224KAHTE; Mouser Price/Stock: https://www.mouser.co.uk/ProductDetail/Taiyo-Yuden/HMK107C7224KAHTE?qs=VWNNG7jHlrKdSvXhIn%252BDVA%3D%3D
C47 = CMP-03422-000286-1: CAP CER 0.1UF 25V X7R 0402; Manufacturer: YAGEO; Tolerance: 0.1; Capacitance: 100 nF; Material: Ceramic; Value: 100 nF; Temperature Coefficient: 30ppm/°C; Automotive Grade: NA; Ipc Land Pattern Name: CAPC10050X50; Lead Free: Yes; Package: CC0402; RoHS: TRUE; Device Class L1: Passive Components; Height: 0.55mm; Temperature Range Low: -55°C; Device Class L2: Capacitors; Octopart: https://octopart.com/cc0402krx7r8bb104-yageo-22850997; ComponentLink2URL: http://www.yageo.com/documents/recent/UPY-GP_NP0_16V-to-50V_16.pdf; ComponentLink2Description: Datasheet; Temperature Range High: +125°C; Temperature Characteristic: X7R; Automotive: No; Device Class L3: Ceramic Capacitors; Temperature: -55°C to +125°C; Manufacturer Part Number: CC0402KRX7R8BB104; Mouser Description: Multilayer Ceramic Capacitors MLCC - SMD/SMT 100nF 25V X7R 10%; Category: Cap; Digikey Description: CAP CER 0.1UF 25V X7R 0402; Voltage Rating: 25 V; Footprint Url: http://www.yageo.com/exep/pages/download/literatures/UPY-C_GEN_24.pdf
C48 C49 = CMP-2008-00756-1: Manufacturer: Vishay; Part Number: VJ0402A101KXAMC
C50 = CMP-2000-05997-2: CAP CER 4.7UF 10V X5R 0402; Dielectric Material: Ceramic; Tolerance: 10%; Series: C; Package Quantity: 10000; Max Operating Temperature: 85°C; Case Code (Imperial): 0402; Lead Free: Lead Free; Voltage Rating (DC): 10V; Packaging: Cut Tape; Voltage Rating: 10V; Min Operating Temperature: -55°C; Dielectric: X5R; Thickness: 0.022inch; Width: 0.02inch; Case/Package: 0402; Case Code (Metric): 1005; Capacitance: 4.7uF; Length: 0.039inch; RoHS Compliant: Yes; REACH SVHC: No SVHC; Mount: Surface Mount
D2-D4 D6 = CMP-12790-000003-1: DIODE SCHOTTKY 30V 30MA SOD523; Manufacturer: Diodes Inc.; Automotive Grade: Grade 1; Peak Reverse Current: 0.5uA; Max Junction Temp: +125°C; Max Repetitive Reverse Voltage: 40V; Value: 2pF; Max Surge Forward Current: 200mA; Mouser Description: Schottky Diodes & Rectifiers 40V 150mW; Footprint Url: https://www.diodes.com/assets/Package-Files/SOD523.pdf; Category: Diode; Reverse Voltage: 30V; ComponentLink2Description: Datasheet; Device Class L2: Diodes; Forward Current: 30mA; Temperature: -40°C to +125°C; Automotive: Yes; Manufacturer Part Number: SDM03U40-7; Octopart: https://octopart.com/sdm03u40-7-diodes+inc.-333863; Digikey Description: DIODE SCHOTTKY 30V 30MA SOD523; Height: 0.65mm; Device Class L3: Schottky Diodes; Package: SOD523; Device Class L1: Discrete Semiconductors; ComponentLink2URL: https://www.diodes.com/assets/Datasheets/ds30392.pdf; RoHS: TRUE; Capacitance: 2pF; Temperature Range Low: -40°C; Lead Free: Yes; Temperature Range High: +125°C
D5 D7 = SS2PH10-M3_84A: Schottky Diode; Manufacturer_Name: Vishay; Manufacturer_Part_Number: SS2PH10-M3/84A; Datasheet Link: https://www.vishay.com/docs/84682/ss2ph9.pdf; Mouser Part Number: 625-SS2PH10-M3; Mouser Price/Stock: https://www.mouser.co.uk/ProductDetail/Vishay-General-Semiconductor/SS2PH10-M3-84A?qs=2u8eEi%2F8yFWdOPY7KNSV1w%3D%3D; Arrow Part Number: SS2PH10-M3/84A; Arrow Price/Stock: https://www.arrow.com/en/products/ss2ph10-m384a/vishay?utm_currency=USD&region=nac
D8 = CMP-12187-000026-1: DIODE SCHOTTKY 40V 300MA SOD523; Manufacturer: STMicroelectronics; Capacitance: 7pF; Value: 7pF; Max Surge Forward Current: 1.25A; Peak Reverse Current: 1uA; Max Junction Temp: +150°C; Device Class L2: Diodes; Temperature Range Low: -40°C; Category: Diode; Manufacturer Part Number: BAT54KFILM; Digikey Description: DIODE SCHOTTKY 40V 300MA SOD523; Device Class L3: Schottky Diodes; Automotive: No; Height: 0.7mm; Octopart: https://octopart.com/bat54kfilm-stmicroelectronics-39618022; ComponentLink2Description: Datasheet; Temperature Range High: +150°C; Device Class L1: Discrete Semiconductors; Max Repetitive Reverse Voltage: 40V; RoHS: TRUE; Temperature: -40°C to +150°C; ComponentLink2URL: https://www.st.com/content/ccc/resource/technical/document/datasheet/07/50/54/f2/0d/ba/4a/79/CD00001322.pdf/files/CD00001322.pdf/jcr:content/translations/en.CD00001322.pdf; Lead Free: Yes; Forward Current: 300mA; Package: SOD-523; Mouser Description: Schottky Diodes & Rectifiers schottky diode
IC1 = NC7SZ08L6X: Integrated Circuit; Manufacturer_Name: onsemi; Datasheet Link: https://www.onsemi.com/pub/Collateral/NC7SZ08-D.PDF; Height: 0.55mm; Manufacturer_Part_Number: NC7SZ08L6X; Mouser Part Number: 512-NC7SZ08L6X; Mouser Price/Stock: https://www.mouser.co.uk/ProductDetail/onsemi-Fairchild/NC7SZ08L6X?qs=u2B728UsA6qfPyNlTO4c7w%3D%3D; Arrow Part Number: NC7SZ08L6X; Arrow Price/Stock: https://www.arrow.com/en/products/nc7sz08l6x/on-semiconductor
IC2 = NC7SZ00L6X: Integrated Circuit; Manufacturer_Name: onsemi; Datasheet Link: https://www.onsemi.com/pub/Collateral/NC7SZ00-D.PDF; Height: 0.55mm; Manufacturer_Part_Number: NC7SZ00L6X; Mouser Part Number: 512-NC7SZ00L6X; Mouser Price/Stock: https://www.mouser.co.uk/ProductDetail/ON-Semiconductor-Fairchild/NC7SZ00L6X/?qs=AFLC8Sm4xaWQG%252BOWUdD%2FRg%3D%3D; Arrow Part Number: NC7SZ00L6X; Arrow Price/Stock: https://www.arrow.com/en/products/nc7sz00l6x/on-semiconductor
J13 J14 = PH1-02-UA: Connector; Manufacturer_Name: Adam Tech; Datasheet Link: https://datasheet.datasheetarchive.com/originals/distributors/Datasheets_SAMA/22522227e000bb8d8f26a3580c1bb98b.pdf; Height: 8.5mm; Manufacturer_Part_Number: PH1-02-UA; Mouser Part Number: 737-PH1-02-UA; Mouser Price/Stock: https://www.mouser.co.uk/ProductDetail/Adam-Tech/PH1-02-UA?qs=HoCaDK9Nz5dVT5LAE%2F6mlA%3D%3D; Arrow Part Number: PH1-02-UA; Arrow Price/Stock: https://www.arrow.com/en/products/ph1-02-ua/adam-tech?utm_currency=USD&region=europe
P5-P7 = CMP-03913-103108763-2: Connector, Tht Mount, Straight, 0.7 Cbl Dia., 50 Ohms, Wr-mmcx; Insertion Loss (dB): 0.25dB; Insulation Resistance: 1GΩ; Connector Type: MMCX; Impedance: 50Ω; Min Operating Temperature: -55°C; Max Operating Temperature: 155°C; Insulation Material: PTFE
Q1 = CMP-166566-000002-1: GAN TRANS 100V 2.8OHM BUMPED DIE; Manufacturer: EPC; Typ Forward Diode Voltage: 2.9V; Number Of Channels: 1; Threshold Vgs Max: 2.5V; Rthja Max: 100°C/W; Continuous Drain Current: 0.5A; Gate Charge At Vgs: 44pC @ 5V; Gate To Source Voltage: 6V; Max Junction Temp: +150°C; Reverse Recovery Charge: 0nC; Depletion Mode: False; Drain To Source Resistance: 2100mΩ; Input Capacitace At Vds: 7pF @ 50V; Threshold Vgs Min: 0.8V; Standoff Height: 0.148mm; Lead Free: Yes; Temperature: -40°C to +150°C; Ipc Land Pattern Name: BGA4N45P2X2_90X90X81; Digikey Description: GAN TRANS 100V 2.8OHM BUMPED DIE; Package: 0; Octopart: https://octopart.com/epc2038-epc-81758250; Drain To Source Breakdown Voltage: 100V; Device Class L2: Transistors; Manufacturer Part Number: EPC2038; Device Class L1: Discrete Semiconductors; Height: 0.815mm; Drain To Source Voltage: 100V; ComponentLink2Description: Datasheet; Technology: GaN; ComponentLink2URL: https://epc-co.com/epc/documents/datasheets/EPC2038_datasheet.pdf; Pulse Drain Current: 0.5A; Temperature Range Low: -40°C; Device Class L3: MOSFETs; Automotive: No; Temperature Range High: +150°C; Number Of N Channels: 1; RoHS: TRUE; Category: Trans
Q2 Q3 = CMP-166566-000008-1: GANFET N-CH 80V 90A DIE; Input Capacitance: 1.94nF; Rds On Max: 2.2mR; Max Operating Temperature: 150°C; Drain to Source Voltage (Vdss): 80V; Packaging: Tape and Reel; Continuous Drain Current (ID): 90A; Mount: Surface Mount; Min Operating Temperature: -40°C
R10 R12 R16 R18 R20 R22 R27 R29 R31 R32 = CMP-26527-007617-1: RES 0 OHM JUMPER 1/16W 0402; Power Rating: 63mW; Working Voltage: 50V; Current Rating: 1A; Resistance: 0R; Series: RMCF; RoHS Compliant: Yes; Features: Automotive AEC-Q200; Width: 0.02inch; Depth: 0.5mm; Resistor Type: Thick Film; Number of Terminations: 2; Radiation Hardening: No; Length: 0.039inch; Contact Plating: Tin; Case/Package: 0402; Min Operating Temperature: -55°C; Case Code (Metric): 1005; Construction: Rectangular; Mount: Surface Mount; Max Operating Temperature: 155°C; Max Power Dissipation: 63mW; Height: 0.016inch; Lead Free: Lead Free; Packaging: Tape and Reel; Technology: THICK FILM; Case Code (Imperial): 0402; Military Standard: Not
R11 = CMP-2002-00549-1: Manufacturer: Panasonic; Part Number: ERJ-2GEJ4R7X
R13 = RC0603FR-0727KL: Resistor, 27 kOhms ±1% 0.1W, 1/10W Chip Resistor 0603 (1608 Metric) Moisture Resistant Thick Film; Manufacturer_Name: YAGEO; Manufacturer_Part_Number: RC0603FR-07100KL; Datasheet Link: https://www.yageo.com/upload/media/product/productsearch/datasheet/rchip/PYu-RC_Group_51_RoHS_L_12.pdf; Height: 0.55mm; Mouser Part Number: 603-RC0603FR-07100KL; Mouser Price/Stock: https://www.mouser.co.uk/ProductDetail/YAGEO/RC0603FR-07100KL?qs=e1ok2LiJcmaihem8Va5%2Fsw%3D%3D; Arrow Part Number: RC0603FR-07100KL; Arrow Price/Stock: https://www.arrow.com/en/products/rc0603fr-07100kl/yageo?utm_currency=USD&region=europe
R14 = CMP-26527-007420-1: 20Ω ±5% 0.063W 0402 Thick Film Chip Resistor AEC-Q200 compliant; Power Rating: 63mW; Resistance: 20R; Temperature Coefficient: 100ppm/°C; Case Code (Imperial): 0402; Length: 0.039inch; Lead Free: Lead Free; Packaging: Tape and Reel; Width: 0.02inch; Max Power Dissipation: 63mW; Max Operating Temperature: 155°C; Construction: Rectangular; Min Operating Temperature: -55°C; Number of Terminations: 2; Case Code (Metric): 1005; Military Standard: Not; Series: RMCF; Tolerance: 5%; Size Code: 0402; RoHS Compliant: Yes; Resistor Type: Thick Film; Mount: Surface Mount; Contact Plating: Tin; Features: Automotive AEC-Q200; Case/Package: 0402; Depth: 0.5mm; Height: 0.016inch; Radiation Hardening: No
R15 R19 R28 R30 = RC0603FR-070RL: as R2 on sheet Logturtle_TX_Toplevel; Datasheet Link: http://www.yageo.com/documents/recent/PYu-RC0603_51_RoHS_L_v5.pdf; Height: 0.55mm; Manufacturer_Part_Number: RC0603FR-070RL; Mouser Part Number: 603-RC0603FR-070RL; Mouser Price/Stock: https://www.mouser.co.uk/ProductDetail/YAGEO/RC0603FR-070RL?qs=0yPvnVz5%2FmpDQv43TwvCfw%3D%3D; Arrow Part Number: RC0603FR-070RL; Arrow Price/Stock: https://www.arrow.com/en/products/rc0603fr-070rl/yageo?region=nac
R17 R21 = CMP-04015-036251-1: 10kΩ ±0.1% 0.125W, 1/8W Chip Resistor 1206 (3216 Metric) Moisture Resistant Thin Film; Voltage Rating: 150V; Power Rating: 125mW; Temperature Coefficient: 10ppm/°C; Resistance: 10kR; Case Code (Imperial): 1206; Weight: 0.000571oz; Composition: Thin Film; Max Operating Temperature: 125°C; Width: 1.6mm; Termination: SMD/SMT; Case/Package: 1206; Voltage Rating (DC): 150V; Tolerance: 0.1%; Min Operating Temperature: -55°C; Packaging: Tape and Reel; Case Code (Metric): 3216; Length: 3.2mm; Height: 0.6mm
R23 R26 = CMP-2002-00507-1: Manufacturer: Panasonic; Part Number: ERJ-2GEJ2R7X
R24 R25 = PT0402FR-7W0R5L: 500 mOhms Â±1% 0.125W, 1/8W Chip Resistor 0402 (1005 Metric) Automotive AEC-Q200, Current Sense, Moisture Resistant Thick Film; MF: Yageo; Price: None; Value: *; Check_prices: https://www.snapeda.com/parts/PT0402FR-7W0R5L/Yageo/view-part/1010867/?ref=eda; Package: 1005 Yageo; SnapEDA_Link: https://www.snapeda.com/parts/PT0402FR-7W0R5L/Yageo/view-part/1010867/?ref=snap; Availability: Bad; MP: PT0402FR-7W0R5L
U3 = CMP-0136-00281-1: 250 mA, 16V, Low Quiescent Current LDO Regulator, 8-Pin DFN, Extended Temperature, Tape and Reel; PackageDescription: 8-Lead Plastic Dual Flat, No Lead Package (MC) - 2x3x0.9mm Body [DFN]; PackageReference: DFN-MC8; PackageVersion: revBB, Aug-2009; DatasheetVersion: revD, Sep-2009
X1 X2 = 3296W-1-101LF: Variable Resistor, 1 kOhms 0.5W, 1/2W PC Pins Through Hole Trimmer Potentiometer Cermet 25.0 Turn Top Adjustment; Manufacturer_Name: Bourns; Value: 1k; Datasheet Link: https://componentsearchengine.com/Datasheets/2/3296W-1-200LF.pdf; Height: 10.28mm; Mouser Price/Stock: https://www.mouser.co.uk/ProductDetail/Bourns/3296W-1-200LF?qs=R4%2FAj8xQbdUOcUUWJIVY1Q%3D%3D; Arrow Price/Stock: https://www.arrow.com/en/products/3296w-1-200lf/bourns?utm_currency=USD&region=nac
Z1 = CD0603-Z5V1: Zener Diode; Manufacturer_Name: Bourns; Datasheet Link: https://media.digikey.com/pdf/Data%20Sheets/Bourns%20PDFs/D0603_1005-Z.pdf; Height: 0.85mm; Manufacturer_Part_Number: CD0603-Z5V1; Mouser Part Number: 652-CD0603-Z5V1; Mouser Price/Stock: https://www.mouser.com/Search/Refine.aspx?Keyword=652-CD0603-Z5V1

## Sheet Tunable_Capacitance.SchDoc
size A4; SheetNumber: 3; SheetTotal: 6
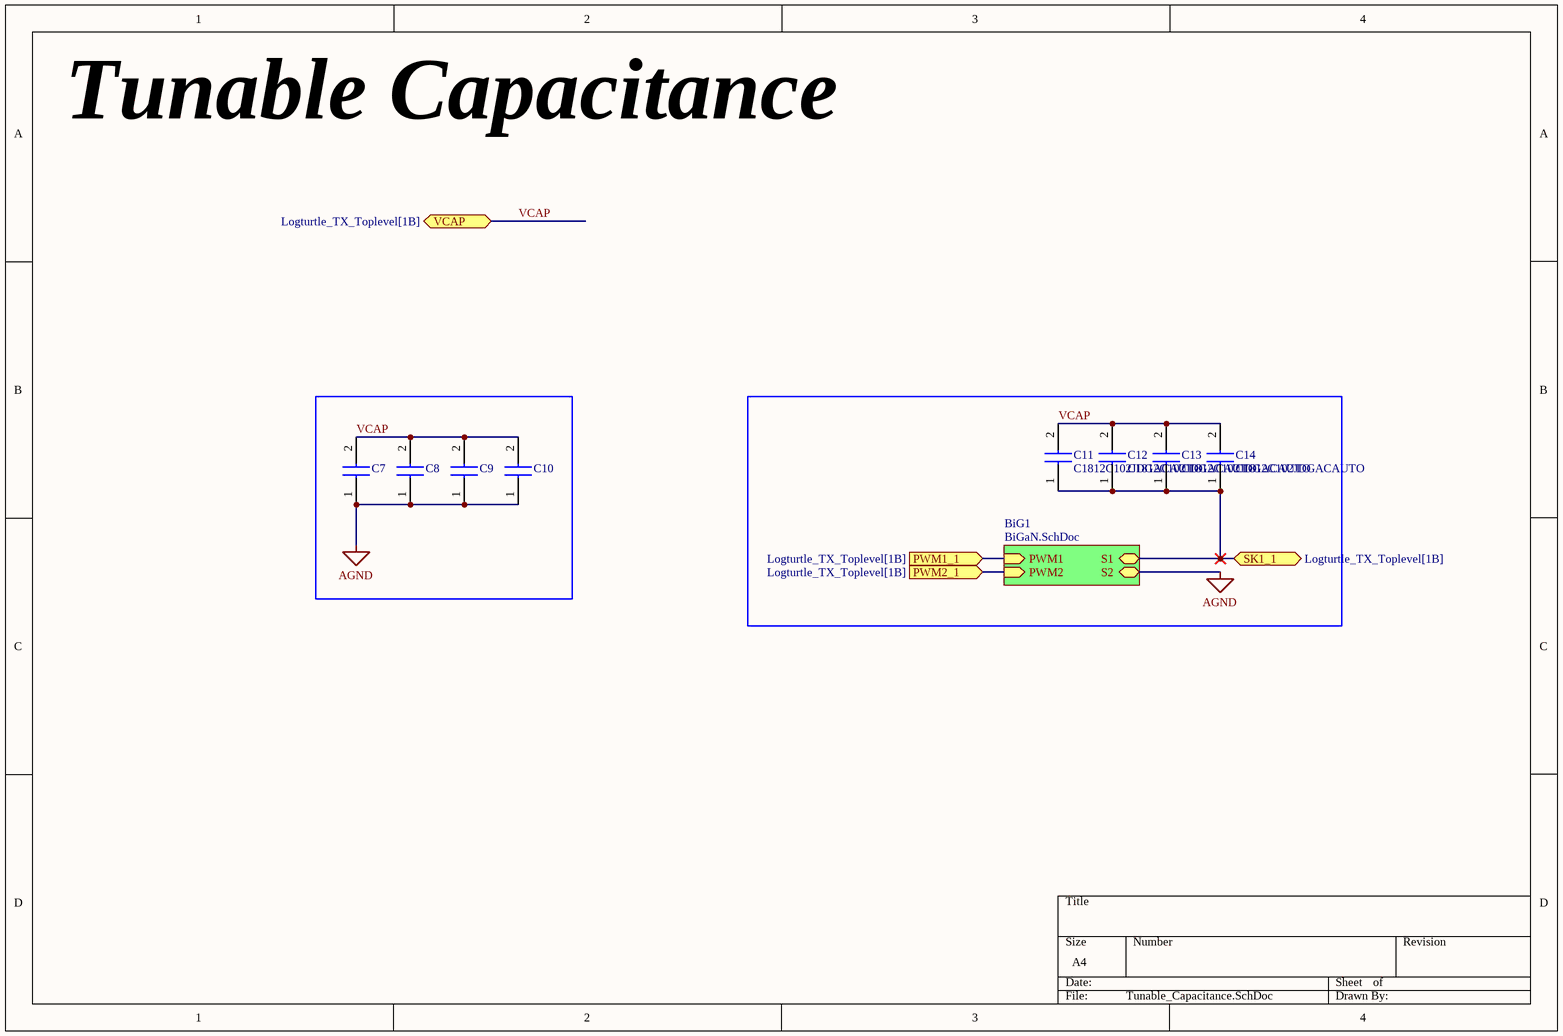
[diagram p3: Tunable_Capacitance.SchDoc]

### Parts
C7  C1812C102JDGACAUTO  [C1812]  (value not drawn)
C8  C1812C102JDGACAUTO  [C1812]  (value not drawn)
C9  C1812C102JDGACAUTO  [C1812]  (value not drawn)
C10  C1812C102JDGACAUTO  [C1812]  (value not drawn)
C11  C1812C102JDGACAUTO  [C1812]
C12  C1812C102JDGACAUTO  [C1812]
C13  C1812C102JDGACAUTO  [C1812]
C14  C1812C102JDGACAUTO  [C1812]

### Sub-sheets
BiG1 = BiGaN.SchDoc: PWM1 (in), PWM2 (in), S1 (bidir), S2 (bidir)

### Ports
PWM1_1 (in, see Logturtle_TX_Toplevel[1B]), PWM2_1 (in, see Logturtle_TX_Toplevel[1B]), SK1_1 (bidir, see Logturtle_TX_Toplevel[1B]), VCAP (bidir, see Logturtle_TX_Toplevel[1B])

### Nets
AGND: C7.1 C8.1 C9.1 C10.1 ; sheet BiG1/S2  [project net S2]
PWM1_1: port PWM1_1, sheet BiG1/PWM1
PWM2_1: port PWM2_1, sheet BiG1/PWM2
S1: C11.1 C12.1 C13.1 C14.1 ; port SK1_1, sheet BiG1/S1
VCAP: C7.2 C8.2 C9.2 C10.2 C11.2 C12.2 C13.2 C14.2 ; port VCAP  [project net SW]

### Notes on the sheet
- Tunable Capacitance

### Library data of the parts
C7-C14 = C1812C102JDGACAUTO: Capacitor; Manufacturer_Name: YAGEO; Datasheet Link: https://content.kemet.com/datasheets/KEM_C1080_C0G_HV_AUTO_SMD.pdf; Height: 1.55mm; Manufacturer_Part_Number: C1812C102JDGACAUTO